# Altium schematic sheet can.SchDoc
size A4; SheetNumber: 3; SheetTotal: 4
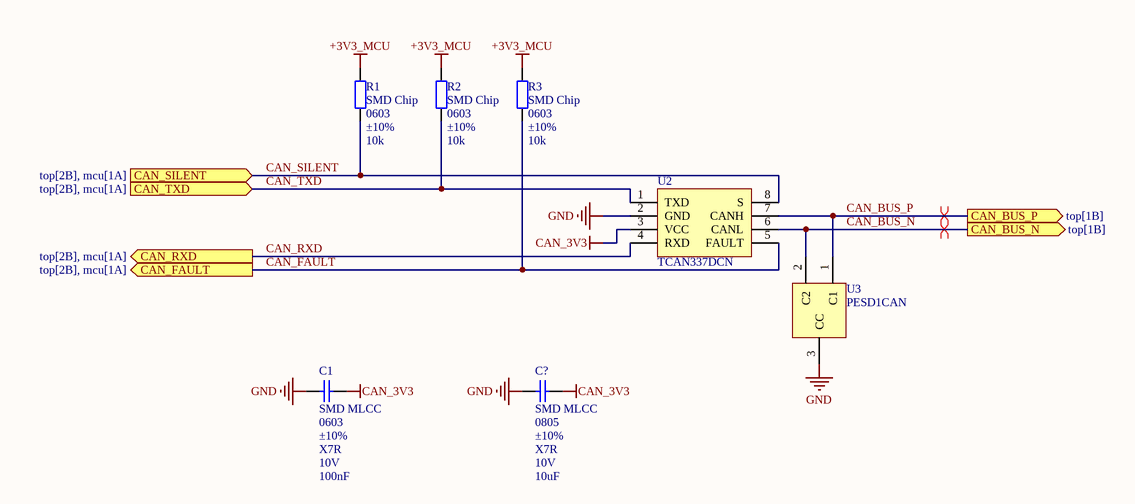
[diagram p0: can.SchDoc]

## Parts
C1  SMD MLCC  Size: 0603  Tolerance: ±10%  Dielectric: X7R  VoltageRating: 10V  Capacitance: 100nF  [SMD_MLCC_CAPACITOR_0603]
C?  SMD MLCC  Size: 0805  Tolerance: ±10%  Dielectric: X7R  VoltageRating: 10V  Capacitance: 10uF  [SMD_MLCC_CAPACITOR_0805]
R1  SMD Chip  Size: 0603  Tolerance: ±10%  Resistance: 10k  [SMD_CHIP_RESISTOR_0603]
R2  SMD Chip  Size: 0603  Tolerance: ±10%  Resistance: 10k  [SMD_CHIP_RESISTOR_0603]
R3  SMD Chip  Size: 0603  Tolerance: ±10%  Resistance: 10k  [SMD_CHIP_RESISTOR_0603]
U2  TCAN337DCN  [TCAN337DCN]
U3  PESD1CAN  [PESD1CAN]

## Ports
CAN_BUS_N (out, see top[1B]), CAN_BUS_P (out, see top[1B]), CAN_FAULT (out, see top[2B], mcu[1A]), CAN_RXD (out, see top[2B], mcu[1A]), CAN_SILENT (in, see top[2B], mcu[1A]), CAN_TXD (in, see top[2B], mcu[1A])

## Nets
+3V3_MCU: R1.2 R2.2 R3.2
CAN_3V3: C1.2 C?.2 U2.3(VCC)
GND: C1.1 C?.1 U2.2(GND) U3.3(CC)
CAN_BUS_N: U2.6(CANL) U3.2(C2) ; port CAN_BUS_N
CAN_BUS_P: U2.7(CANH) U3.1(C1) ; port CAN_BUS_P
CAN_FAULT: R3.1 U2.5(FAULT) ; port CAN_FAULT
CAN_RXD: U2.4(RXD) ; port CAN_RXD
CAN_SILENT: R1.1 U2.8(S) ; port CAN_SILENT
CAN_TXD: R2.1 U2.1(TXD) ; port CAN_TXD

## Layout directives
differential pair: CAN_BUS_N, CAN_BUS_P

## Library data of the parts
C1 C? = SMD MLCC Capacitor: generic SMD MLCC capacitor
R1-R3 = SMD Chip Resistor: generic SMD chip resistor; PowerRating: /
U2 = TCAN337DCN: CAN physical; Supplier 1: Mouser; Supplier Part Number 1: 595-TCAN337DCNT
U3 = PESD1CAN: CAN ESD protection; Supplier 1: Future Electronics; Supplier Part Number 1: 6297154